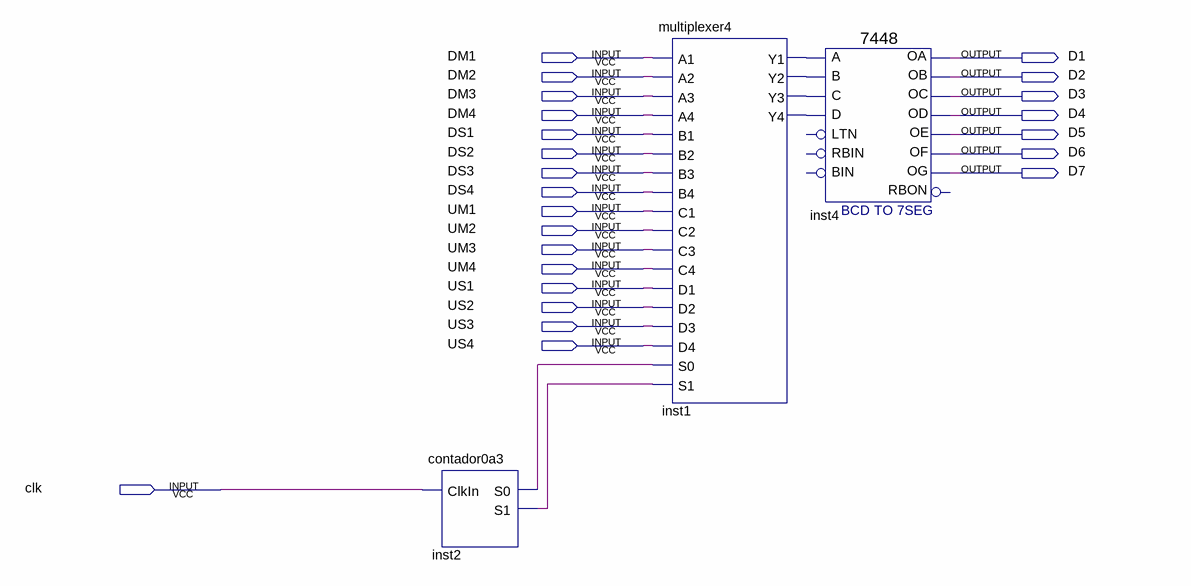
[diagram p0: schematic sheet]
// Quartus schematic muxBCD7Seg.bdf as structural Verilog: 3 symbols, 24 pins
module muxBCD7Seg (
  input  DM1,
  input  DM2,
  input  DM3,
  input  DM4,
  input  DS1,
  input  DS2,
  input  DS3,
  input  DS4,
  input  UM1,
  input  UM2,
  input  UM3,
  input  UM4,
  input  US1,
  input  US2,
  input  US3,
  input  US4,
  input  clk,
  output D1,
  output D2,
  output D3,
  output D4,
  output D5,
  output D6,
  output D7
);

  wire inst1_y1, inst1_y2, inst1_y3, inst1_y4, inst2_s0, inst2_s1;

  contador0a3 inst2 (.ClkIn(clk), .S0(inst2_s0), .S1(inst2_s1));
  multiplexer4 inst1 (
    .A1(DM1), .A2(DM2), .A3(DM3), .A4(DM4), .B1(DS1), .B2(DS2), .B3(DS3), .B4(DS4), .C1(UM1), .C2(UM2),
    .C3(UM3), .C4(UM4), .D1(US1), .D2(US2), .D3(US3), .D4(US4), .S0(inst2_s0), .S1(inst2_s1), .Y1(inst1_y1),
    .Y2(inst1_y2), .Y3(inst1_y3), .Y4(inst1_y4));
  \7448  inst4 (
    .A(inst1_y1), .C(inst1_y3), .D(inst1_y4), .B(inst1_y2), .OC(D3), .OE(D5), .OD(D4), .OF(D6), .OG(D7),
    .OB(D2), .OA(D1));  // open: RBIN, BIN, LTN, RBON
endmodule
